# Altium schematic sheet Sheet1.SchDoc
size 292 x 241 mm; SheetNumber: 1; SheetTotal: 1
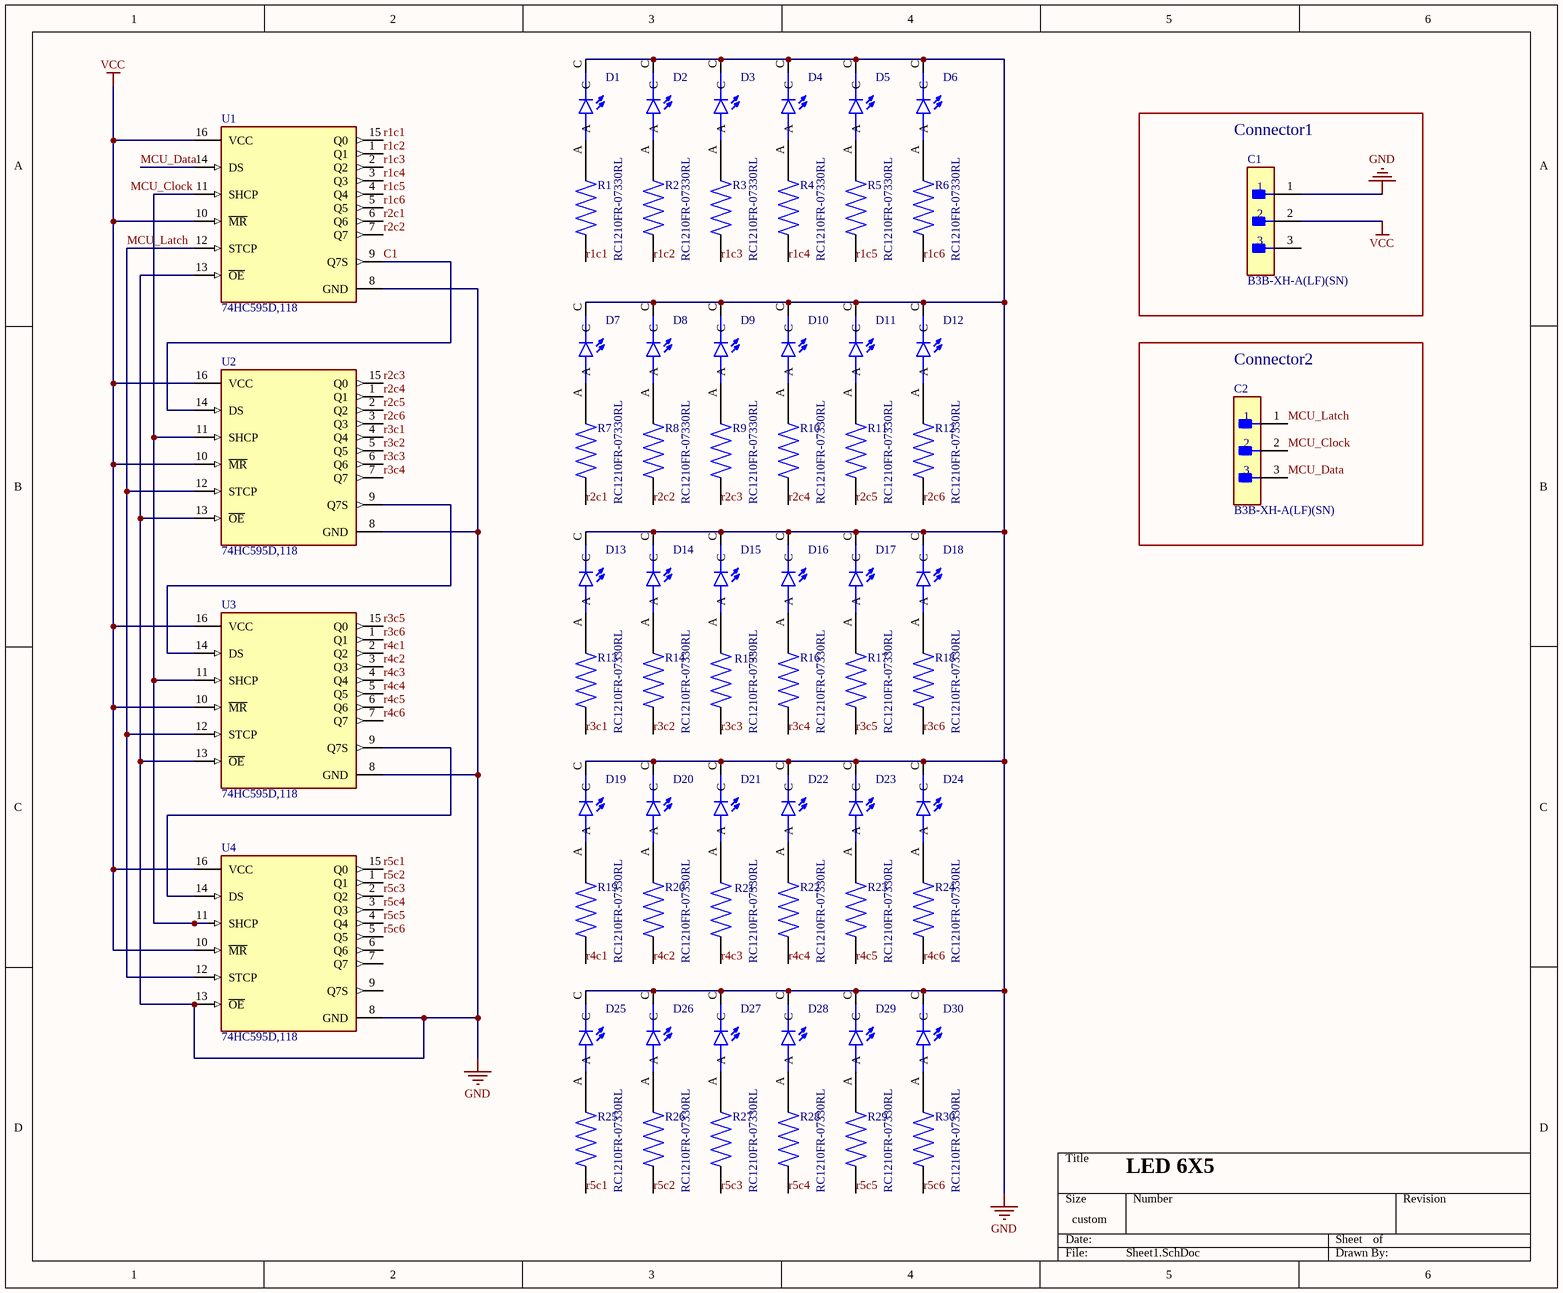
[diagram p0: Sheet1.SchDoc]

## Parts
C1  B3B-XH-A(LF)(SN)  [FP-B3B-XH-A_LF_SN-MFG]
C2  B3B-XH-A(LF)(SN)  [FP-B3B-XH-A_LF_SN-MFG]
D1  WP7113ID  [LED_WP7113ID]  (value not drawn)
D2  WP7113ID  [LED_WP7113ID]  (value not drawn)
D3  WP7113ID  [LED_WP7113ID]  (value not drawn)
D4  WP7113ID  [LED_WP7113ID]  (value not drawn)
D5  WP7113ID  [LED_WP7113ID]  (value not drawn)
D6  WP7113ID  [LED_WP7113ID]  (value not drawn)
D7  WP7113ID  [LED_WP7113ID]  (value not drawn)
D8  WP7113ID  [LED_WP7113ID]  (value not drawn)
D9  WP7113ID  [LED_WP7113ID]  (value not drawn)
D10  WP7113ID  [LED_WP7113ID]  (value not drawn)
D11  WP7113ID  [LED_WP7113ID]  (value not drawn)
D12  WP7113ID  [LED_WP7113ID]  (value not drawn)
D13  WP7113ID  [LED_WP7113ID]  (value not drawn)
D14  WP7113ID  [LED_WP7113ID]  (value not drawn)
D15  WP7113ID  [LED_WP7113ID]  (value not drawn)
D16  WP7113ID  [LED_WP7113ID]  (value not drawn)
D17  WP7113ID  [LED_WP7113ID]  (value not drawn)
D18  WP7113ID  [LED_WP7113ID]  (value not drawn)
D19  WP7113ID  [LED_WP7113ID]  (value not drawn)
D20  WP7113ID  [LED_WP7113ID]  (value not drawn)
D21  WP7113ID  [LED_WP7113ID]  (value not drawn)
D22  WP7113ID  [LED_WP7113ID]  (value not drawn)
D23  WP7113ID  [LED_WP7113ID]  (value not drawn)
D24  WP7113ID  [LED_WP7113ID]  (value not drawn)
D25  WP7113ID  [LED_WP7113ID]  (value not drawn)
D26  WP7113ID  [LED_WP7113ID]  (value not drawn)
D27  WP7113ID  [LED_WP7113ID]  (value not drawn)
D28  WP7113ID  [LED_WP7113ID]  (value not drawn)
D29  WP7113ID  [LED_WP7113ID]  (value not drawn)
D30  WP7113ID  [LED_WP7113ID]  (value not drawn)
R1  RC1210FR-07330RL  [RESC3126X65N]
R2  RC1210FR-07330RL  [RESC3126X65N]
R3  RC1210FR-07330RL  [RESC3126X65N]
R4  RC1210FR-07330RL  [RESC3126X65N]
R5  RC1210FR-07330RL  [RESC3126X65N]
R6  RC1210FR-07330RL  [RESC3126X65N]
R7  RC1210FR-07330RL  [RESC3126X65N]
R8  RC1210FR-07330RL  [RESC3126X65N]
R9  RC1210FR-07330RL  [RESC3126X65N]
R10  RC1210FR-07330RL  [RESC3126X65N]
R11  RC1210FR-07330RL  [RESC3126X65N]
R12  RC1210FR-07330RL  [RESC3126X65N]
R13  RC1210FR-07330RL  [RESC3126X65N]
R14  RC1210FR-07330RL  [RESC3126X65N]
R15  RC1210FR-07330RL  [RESC3126X65N]
R16  RC1210FR-07330RL  [RESC3126X65N]
R17  RC1210FR-07330RL  [RESC3126X65N]
R18  RC1210FR-07330RL  [RESC3126X65N]
R19  RC1210FR-07330RL  [RESC3126X65N]
R20  RC1210FR-07330RL  [RESC3126X65N]
R21  RC1210FR-07330RL  [RESC3126X65N]
R22  RC1210FR-07330RL  [RESC3126X65N]
R23  RC1210FR-07330RL  [RESC3126X65N]
R24  RC1210FR-07330RL  [RESC3126X65N]
R25  RC1210FR-07330RL  [RESC3126X65N]
R26  RC1210FR-07330RL  [RESC3126X65N]
R27  RC1210FR-07330RL  [RESC3126X65N]
R28  RC1210FR-07330RL  [RESC3126X65N]
R29  RC1210FR-07330RL  [RESC3126X65N]
R30  RC1210FR-07330RL  [RESC3126X65N]
U1  74HC595D,118  [FP-SOT109-1-IPC_C]
U2  74HC595D,118  [FP-SOT109-1-IPC_C]
U3  74HC595D,118  [FP-SOT109-1-IPC_C]
U4  74HC595D,118  [FP-SOT109-1-IPC_C]

## Blocks framed on the sheet
Connector1: C1
Connector2: C2

## Nets
GND: C1.1 D1.C D2.C D3.C D4.C D5.C D6.C D7.C D8.C D9.C D10.C D11.C D12.C D13.C D14.C D15.C D16.C D17.C D18.C D19.C D20.C D21.C D22.C D23.C D24.C D25.C D26.C D27.C D28.C D29.C D30.C U1.8(GND) U1.13(~{OE}) U2.8(GND) U2.13(~{OE}) U3.8(GND) U3.13(~{OE}) U4.8(GND) U4.13(~{OE})
VCC: C1.2 U1.10(~{MR}) U1.16(VCC) U2.10(~{MR}) U2.16(VCC) U3.10(~{MR}) U3.16(VCC) U4.10(~{MR}) U4.16(VCC)
C1: U1.9(Q7S) U2.14(DS)
MCU_Clock: C2.2 U1.11(SHCP) U2.11(SHCP) U3.11(SHCP) U4.11(SHCP)
MCU_Data: C2.3 U1.14(DS)
MCU_Latch: C2.1 U1.12(STCP) U2.12(STCP) U3.12(STCP) U4.12(STCP)
r1c1: R1.1 U1.15(Q0)
r1c2: R2.1 U1.1(Q1)
r1c3: R3.1 U1.2(Q2)
r1c4: R4.1 U1.3(Q3)
r1c5: R5.1 U1.4(Q4)
r1c6: R6.1 U1.5(Q5)
r2c1: R7.1 U1.6(Q6)
r2c2: R8.1 U1.7(Q7)
r2c3: R9.1 U2.15(Q0)
r2c4: R10.1 U2.1(Q1)
r2c5: R11.1 U2.2(Q2)
r2c6: R12.1 U2.3(Q3)
r3c1: R13.1 U2.4(Q4)
r3c2: R14.1 U2.5(Q5)
r3c3: R15.1 U2.6(Q6)
r3c4: R16.1 U2.7(Q7)
r3c5: R17.1 U3.15(Q0)
r3c6: R18.1 U3.1(Q1)
r4c1: R19.1 U3.2(Q2)
r4c2: R20.1 U3.3(Q3)
r4c3: R21.1 U3.4(Q4)
r4c4: R22.1 U3.5(Q5)
r4c5: R23.1 U3.6(Q6)
r4c6: R24.1 U3.7(Q7)
r5c1: R25.1 U4.15(Q0)
r5c2: R26.1 U4.1(Q1)
r5c3: R27.1 U4.2(Q2)
r5c4: R28.1 U4.3(Q3)
r5c5: R29.1 U4.4(Q4)
r5c6: R30.1 U4.5(Q5)
NetD1_A: D1.A R1.2
NetD2_A: D2.A R2.2
NetD3_A: D3.A R3.2
NetD4_A: D4.A R4.2
NetD5_A: D5.A R5.2
NetD6_A: D6.A R6.2
NetD7_A: D7.A R7.2
NetD8_A: D8.A R8.2
NetD9_A: D9.A R9.2
NetD10_A: D10.A R10.2
NetD11_A: D11.A R11.2
NetD12_A: D12.A R12.2
NetD13_A: D13.A R13.2
NetD14_A: D14.A R14.2
NetD15_A: D15.A R15.2
NetD16_A: D16.A R16.2
NetD17_A: D17.A R17.2
NetD18_A: D18.A R18.2
NetD19_A: D19.A R19.2
NetD20_A: D20.A R20.2
NetD21_A: D21.A R21.2
NetD22_A: D22.A R22.2
NetD23_A: D23.A R23.2
NetD24_A: D24.A R24.2
NetD25_A: D25.A R25.2
NetD26_A: D26.A R26.2
NetD27_A: D27.A R27.2
NetD28_A: D28.A R28.2
NetD29_A: D29.A R29.2
NetD30_A: D30.A R30.2
NetU2_9: U2.9(Q7S) U3.14(DS)
NetU3_9: U3.9(Q7S) U4.14(DS)

Not connected (* = marked no-connect by the designer): C1 3; U4 6(Q6) 7(Q7) 9(Q7S)

## Notes on the sheet
- LED 6X5

## Library data of the parts
C1 C2 = CMP-17439-000014-3: CONN HEADER VERT 3POS 2.5MM; Max Voltage Rating (DC): 250V; Number of Positions: 3; Current Rating: 3A; Color: Natural; Gender: Male; Wire/Cable Gauge: 22AWG; Contact Resistance: 20mR; Insulation Resistance: 1GR; Insulation Material: Nylon; Contact Plating: Tin; Depth: 5.75mm; Contact Type: Male Pin; Max Operating Temperature: 85°C; Insulation Color: Natural; Voltage Rating (AC): 250V; Connector Type: Header; Orientation: Straight; Fastening Type: Detent; Housing Color: White; Min Operating Temperature: -25°C; Termination: Solder; Voltage Rating: 250V; Series: XH; Pitch: 2.5mm; Contact Shape: Square; Number of Rows: 1; Lead Free: Lead Free; Packaging: Bulk; Mount: Through Hole; Flammability Rating: UL94 V-0; Max Voltage Rating (AC): 250V; REACH SVHC: No SVHC; Housing Material: Polyamide; Contact Material: Brass; Lead Pitch: 2.5mm; Contact Finish - Mating: TIN; Length: 9.9mm; Max Current Rating: 3A; Number of Contacts: 3
D1-D30 = WP7113ID: Red 617nm LED Indication - Discrete 2V Radial; MF: Kingbright; Price: None; MP: WP7113ID; Package: Radial Kingbright; Check_prices: https://www.snapeda.com/parts/WP7113ID/Kingbright/view-part/?ref=eda; Purchase-URL: https://pricing.snapeda.com/search/part/WP7113ID/?ref=eda; Availability: In Stock; Value: *; SnapEDA_Link: https://www.snapeda.com/parts/WP7113ID/Kingbright/view-part/?ref=snap
R1-R30 = RC1210FR-07330RL: 330 Ohms Â±1% 0.5W, 1/2W Chip Resistor 1210 (3225 Metric) Moisture Resistant Thick Film; MF: Yageo; SnapEDA_Link: https://www.snapeda.com/parts/RC1210FR-07330RL/Yageo/view-part/?ref=snap; Package: 3126 Yageo; Value: *; MP: RC1210FR-07330RL; Check_prices: https://www.snapeda.com/parts/RC1210FR-07330RL/Yageo/view-part/?ref=eda
U1-U4 = CMP-14351-000006-1: IC SHIFT REGISTER 8BIT 16SOIC; RoHS Compliant: Yes